# Altium schematic sheet COVER.SchDoc
size A4; SheetNumber: 1; SheetTotal: 4
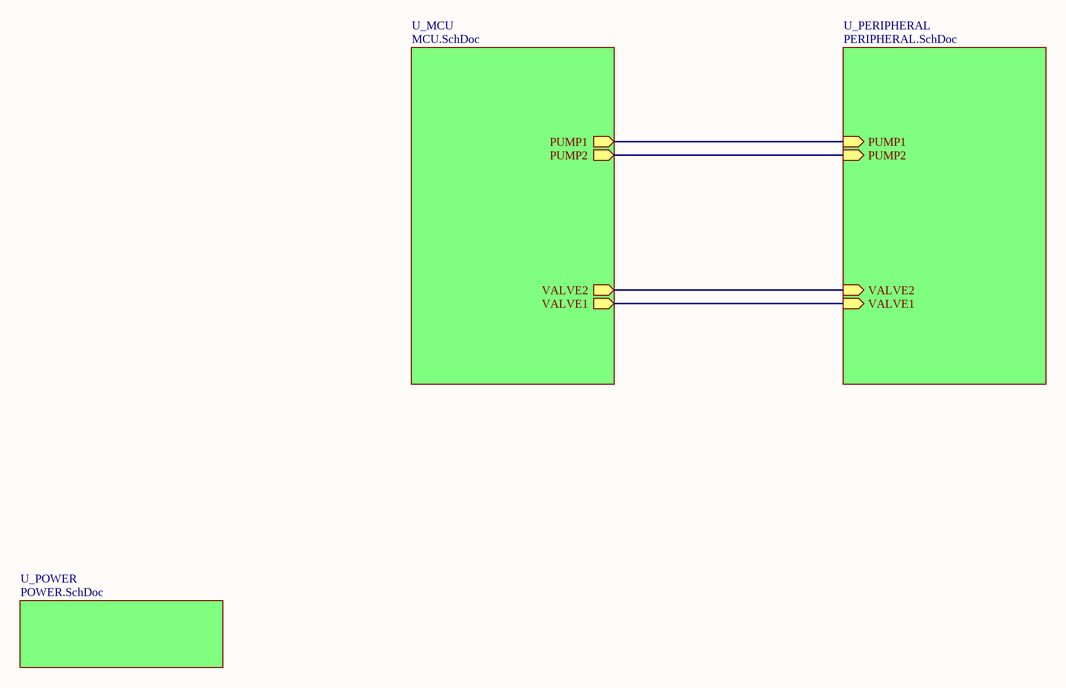
[diagram p0: COVER.SchDoc]

## Sub-sheets
U_MCU = MCU.SchDoc: PUMP1 (out), PUMP2 (out), VALVE2 (out), VALVE1 (out)
U_PERIPHERAL = PERIPHERAL.SchDoc: VALVE2 (in), VALVE1 (in), PUMP2 (in), PUMP1 (in)
U_POWER = POWER.SchDoc: no entries

## Nets
(unnamed): sheet U_MCU/PUMP1, sheet U_PERIPHERAL/PUMP1
(unnamed): sheet U_MCU/PUMP2, sheet U_PERIPHERAL/PUMP2
(unnamed): sheet U_MCU/VALVE2, sheet U_PERIPHERAL/VALVE2
(unnamed): sheet U_MCU/VALVE1, sheet U_PERIPHERAL/VALVE1